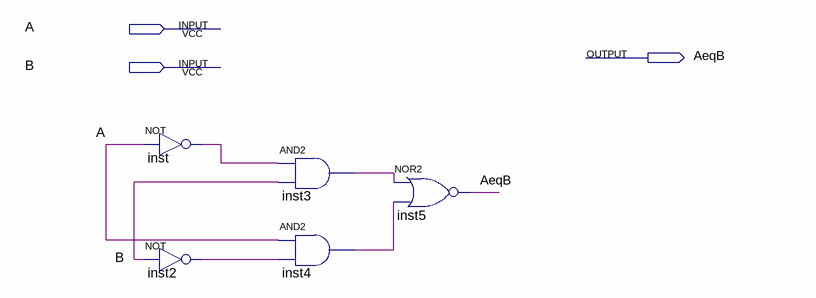
[diagram p0: schematic sheet]
// Quartus schematic g14_2bitcomp.bdf as structural Verilog: 5 symbols, 3 pins
module g14_2bitcomp (
  input  A,
  input  B,
  output AeqB
);

  wire inst2_out, inst3_out, inst4_out, inst_out;

  not inst (inst_out, A);
  not inst2 (inst2_out, B);
  and inst3 (inst3_out, inst_out, B);
  and inst4 (inst4_out, A, inst2_out);
  nor inst5 (AeqB, inst3_out, inst4_out);
endmodule
